# EAGLE design vemag_CPU_v2_2 (EAGLE 9.6.2)

## Sheet 1 of 3: Microcontroller
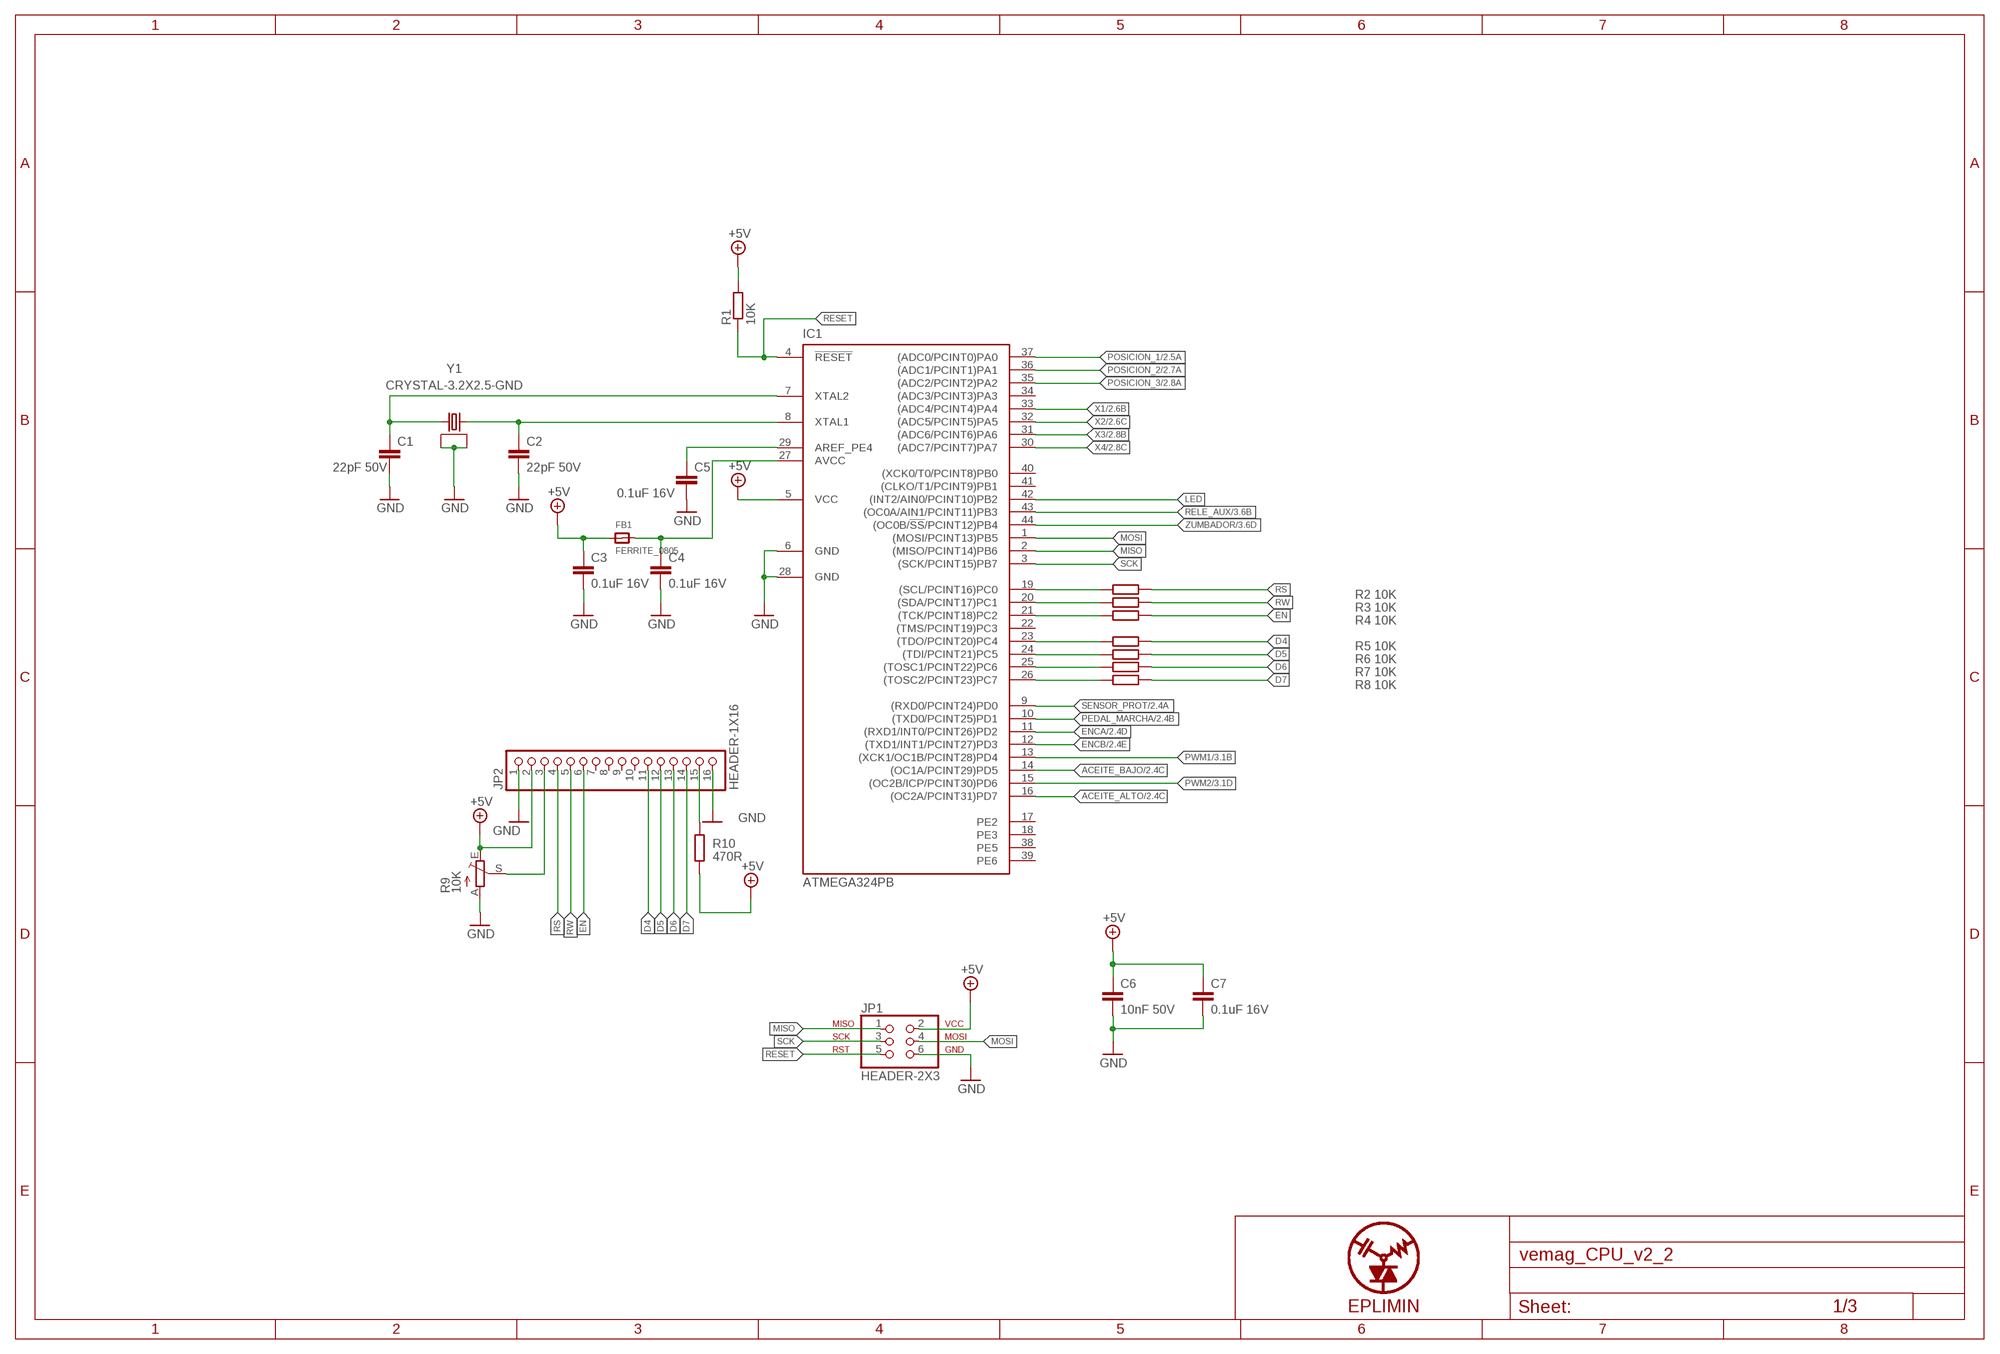
[diagram p0: schematic, sheet 1]

### Parts
C1  22pF 50V  C-EUC0603  [C0603]
C2  22pF 50V  C-EUC0603  [C0603]
C3  0.1uF 16V  C-EUC0603  [C0603]
C4  0.1uF 16V  C-EUC0603  [C0603]
C5  0.1uF 16V  C-EUC0603  [C0603]
C6  10nF 50V  C-EUC0603  [C0603]
C7  0.1uF 16V  C-EUC0603  [C0603]
FB1  FERRITE_0805  [_0805]
IC1  ATMEGA324PB  [TQFP44]
JP1  HEADER-2X3  ISP_AVR_6P  [ISP_AVR_6P]
JP2  HEADER-1X16  PINHD-1X16  [1X16]
R1  10K  R-EU_R0805  [R0805]
R2  10K  R-EU_R0805  [R0805]
R3  10K  R-EU_R0805  [R0805]
R4  10K  R-EU_R0805  [R0805]
R5  10K  R-EU_R0805  [R0805]
R6  10K  R-EU_R0805  [R0805]
R7  10K  R-EU_R0805  [R0805]
R8  10K  R-EU_R0805  [R0805]
R9  10K  TRIM_EU-CA6V  [CA6V]
R10  470R  R-EU_R0805  [R0805]
Y1  CRYSTAL-3.2X2.5-GND  [CRYSTAL-SMD-3.2X2.5MM]

### Nets
+5V: C3.1 C6.1 C7.1 FB1.1 IC1.5(VCC) JP1.2 JP2.2 R1.2 R9.E R10.1 ; also sheet 2
ACEITE_ALTO: IC1.16((OC2A/PCINT31)PD7) ; also sheet 2
ACEITE_BAJO: IC1.14((OC1A/PCINT29)PD5) ; also sheet 2
D4: JP2.11 R5.1
D5: JP2.12 R6.1
D6: JP2.13 R7.1
D7: JP2.14 R8.1
EN: JP2.6 R4.1
ENCA: IC1.11((RXD1/INT0/PCINT26)PD2) ; also sheet 2
ENCB: IC1.12((TXD1/INT1/PCINT27)PD3) ; also sheet 2
GND: C1.2 C2.2 C3.2 C4.2 C5.2 C6.2 C7.2 IC1.6(GND) IC1.28(GND) JP1.6 JP2.1 JP2.16 R9.A Y1.2(GND) Y1.4(GND) ; also sheet 2,3
LED: IC1.42((INT2/AIN0/PCINT10)PB2)
MISO: IC1.2((MISO/PCINT14)PB6) JP1.1
MOSI: IC1.1((MOSI/PCINT13)PB5) JP1.4
N$1: C1.1 IC1.7(XTAL2) Y1.1
N$2: C2.1 IC1.8(XTAL1) Y1.3
N$3: C5.1 IC1.29(AREF_PE4)
N$4: JP2.3 R9.S
N$5: C4.1 FB1.2 IC1.27(AVCC)
N$6: IC1.26((TOSC2/PCINT23)PC7) R8.2
N$7: IC1.25((TOSC1/PCINT22)PC6) R7.2
N$8: IC1.24((TDI/PCINT21)PC5) R6.2
N$9: IC1.23((TDO/PCINT20)PC4) R5.2
N$11: IC1.21((TCK/PCINT18)PC2) R4.2
N$12: IC1.20((SDA/PCINT17)PC1) R3.2
N$13: IC1.19((SCL/PCINT16)PC0) R2.2
N$14: JP2.15 R10.2
PEDAL_MARCHA: IC1.10((TXD0/PCINT25)PD1) ; also sheet 2
POSICION_1: IC1.37((ADC0/PCINT0)PA0) ; also sheet 2
POSICION_2: IC1.36((ADC1/PCINT1)PA1) ; also sheet 2
POSICION_3: IC1.35((ADC2/PCINT2)PA2) ; also sheet 2
PWM1: IC1.13((XCK1/OC1B/PCINT28)PD4) ; also sheet 3
PWM2: IC1.15((OC2B/ICP/PCINT30)PD6) ; also sheet 3
RELE_AUX: IC1.43((OC0A/AIN1/PCINT11)PB3) ; also sheet 3
RESET: IC1.4(!RESET) JP1.5 R1.1
RS: JP2.4 R2.1
RW: JP2.5 R3.1
SCK: IC1.3((SCK/PCINT15)PB7) JP1.3
SENSOR_PROT: IC1.9((RXD0/PCINT24)PD0) ; also sheet 2
X1: IC1.33((ADC4/PCINT4)PA4) ; also sheet 2
X2: IC1.32((ADC5/PCINT5)PA5) ; also sheet 2
X3: IC1.31((ADC6/PCINT6)PA6) ; also sheet 2
X4: IC1.30((ADC7/PCINT7)PA7) ; also sheet 2
ZUMBADOR: IC1.44((OC0B/!SS!/PCINT12)PB4) ; also sheet 3
Unconnected: IC1.22((TMS/PCINT19)PC3) IC1.34((ADC3/PCINT3)PA3) IC1.40((XCK0/T0/PCINT8)PB0) IC1.41((CLKO/T1/PCINT9)PB1) JP2.7 JP2.8 JP2.9 JP2.10

## Sheet 2 of 3: Inputs / Power Supply
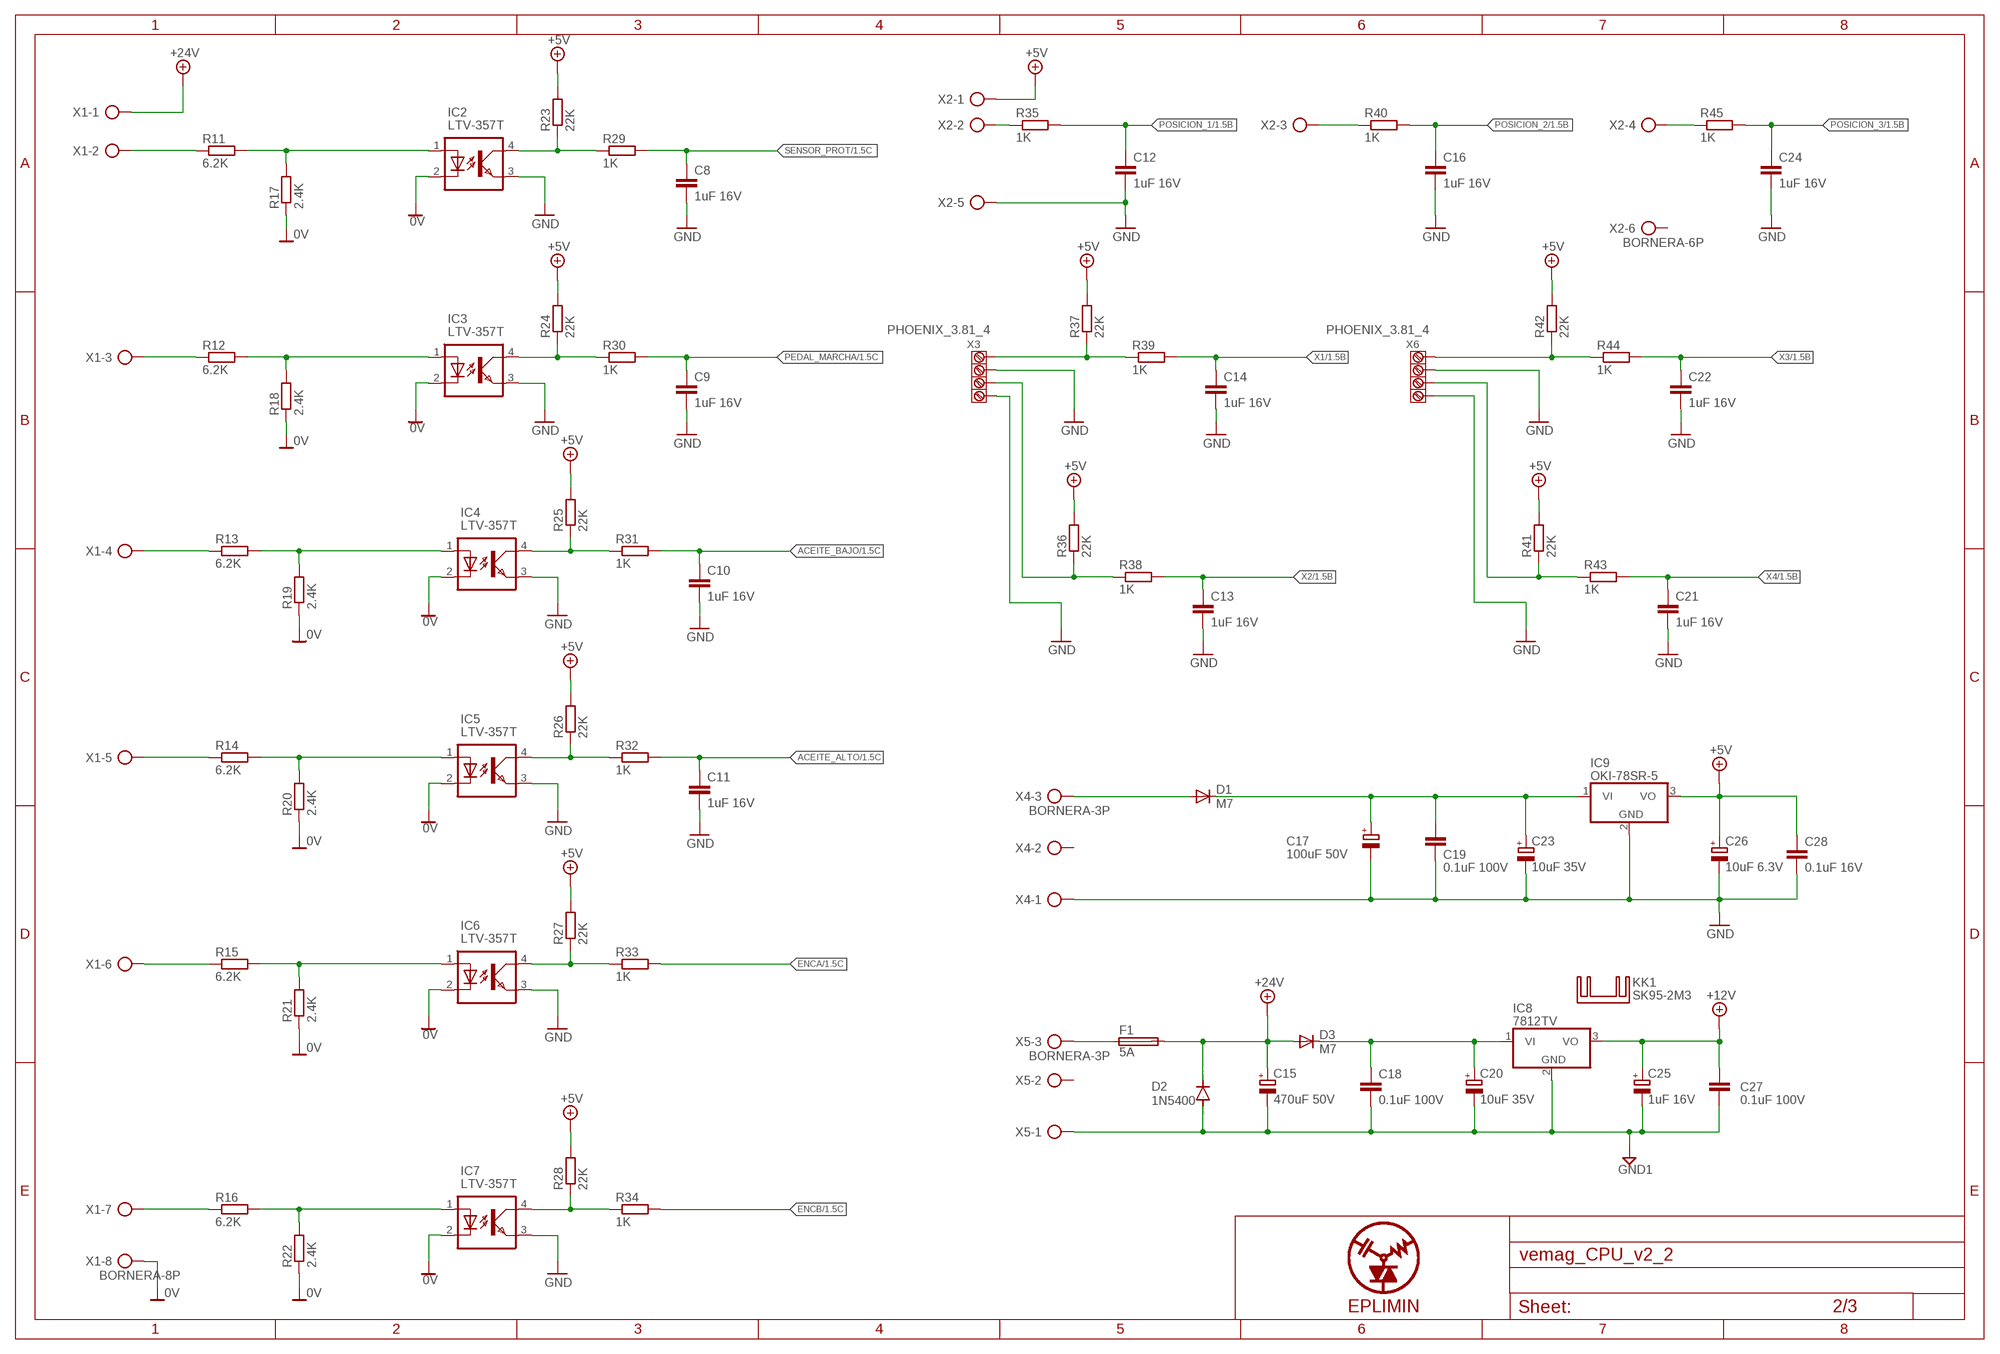
[diagram p1: schematic, sheet 2]

### Parts
C8  1uF 16V  C-EUC0805  [C0805]
C9  1uF 16V  C-EUC0805  [C0805]
C10  1uF 16V  C-EUC0805  [C0805]
C11  1uF 16V  C-EUC0805  [C0805]
C12  1uF 16V  C-EUC0805  [C0805]
C13  1uF 16V  C-EUC0805  [C0805]
C14  1uF 16V  C-EUC0805  [C0805]
C15  470uF 50V  CPOL-EUE10-20  [EB20D]
C16  1uF 16V  C-EUC0805  [C0805]
C17  100uF 50V  CPOL-EUE5-10.5  [E5-10,5]
C18  0.1uF 100V  C-EU050-035X075  [C050-035X075]
C19  0.1uF 100V  C-EU050-035X075  [C050-035X075]
C20  10uF 35V  CPOL-EUSMCD  [SMC_D]
C21  1uF 16V  C-EUC0805  [C0805]
C22  1uF 16V  C-EUC0805  [C0805]
C23  10uF 35V  CPOL-EUSMCD  [SMC_D]
C24  1uF 16V  C-EUC0805  [C0805]
C25  1uF 16V  CPOL-EUSMCC  [SMC_C]
C26  10uF 6.3V  CPOL-EUSMCC  [SMC_C]
C27  0.1uF 100V  C-EU050-035X075  [C050-035X075]
C28  0.1uF 16V  C-EUC0603  [C0603]
D1  M7  [DIODE_DO-214AC]
D2  1N5400  [DO201-15]
D3  M7  [DIODE_DO-214AC]
F1  5A  TR5  [TR5]
IC2  LTV-357T  [LTV-357T]
IC3  LTV-357T  [LTV-357T]
IC4  LTV-357T  [LTV-357T]
IC5  LTV-357T  [LTV-357T]
IC6  LTV-357T  [LTV-357T]
IC7  LTV-357T  [LTV-357T]
IC8  7812TV  [TO220V]
IC9  OKI-78SR-5  OKI-78SR_V  [TO220V-OKI-ISO]
KK1  SK95-2M3  [SK95-2M3]
R11  6.2K  R-EU_R1206  [R1206]
R12  6.2K  R-EU_R1206  [R1206]
R13  6.2K  R-EU_R1206  [R1206]
R14  6.2K  R-EU_R1206  [R1206]
R15  6.2K  R-EU_R1206  [R1206]
R16  6.2K  R-EU_R1206  [R1206]
R17  2.4K  R-EU_R1206  [R1206]
R18  2.4K  R-EU_R1206  [R1206]
R19  2.4K  R-EU_R1206  [R1206]
R20  2.4K  R-EU_R1206  [R1206]
R21  2.4K  R-EU_R1206  [R1206]
R22  2.4K  R-EU_R1206  [R1206]
R23  22K  R-EU_R0805  [R0805]
R24  22K  R-EU_R0805  [R0805]
R25  22K  R-EU_R0805  [R0805]
R26  22K  R-EU_R0805  [R0805]
R27  22K  R-EU_R0805  [R0805]
R28  22K  R-EU_R0805  [R0805]
R29  1K  R-EU_R0805  [R0805]
R30  1K  R-EU_R0805  [R0805]
R31  1K  R-EU_R0805  [R0805]
R32  1K  R-EU_R0805  [R0805]
R33  1K  R-EU_R0805  [R0805]
R34  1K  R-EU_R0805  [R0805]
R35  1K  R-EU_R0805  [R0805]
R36  22K  R-EU_R0805  [R0805]
R37  22K  R-EU_R0805  [R0805]
R38  1K  R-EU_R0805  [R0805]
R39  1K  R-EU_R0805  [R0805]
R40  1K  R-EU_R0805  [R0805]
R41  22K  R-EU_R0805  [R0805]
R42  22K  R-EU_R0805  [R0805]
R43  1K  R-EU_R0805  [R0805]
R44  1K  R-EU_R0805  [R0805]
R45  1K  R-EU_R0805  [R0805]
X1  BORNERA-8P  AK500/8  [AK500/8]
X2  BORNERA-6P  AK500/6  [AK500/6]
X3  PHOENIX_3.81_4  [3.81-4]
X4  BORNERA-3P  AK500/3  [AK500/3]
X5  BORNERA-3P  AK500/3  [AK500/3]
X6  PHOENIX_3.81_4  [3.81-4]

### Nets
0V: IC2.2(CATHODE) IC3.2(CATHODE) IC4.2(CATHODE) IC5.2(CATHODE) IC6.2(CATHODE) IC7.2(CATHODE) R17.1 R18.1 R19.1 R20.1 R21.1 R22.1 X1.8
+5V: C26.+ C28.1 IC9.3(VO) R23.2 R24.2 R25.2 R26.2 R27.2 R28.2 R36.2 R37.2 R41.2 R42.2 X2.1 ; also sheet 1
+12V: C25.+ C27.1 IC8.3(VO) ; also sheet 3
+24V: C15.+ D2.C D3.A F1.2 X1.1 ; also sheet 3
ACEITE_ALTO: C11.1 R32.2 ; also sheet 1
ACEITE_BAJO: C10.1 R31.2 ; also sheet 1
ENCA: R33.2 ; also sheet 1
ENCB: R34.2 ; also sheet 1
GND: C8.2 C9.2 C10.2 C11.2 C12.2 C13.2 C14.2 C16.2 C17.- C19.2 C21.2 C22.2 C23.- C24.2 C26.- C28.2 IC2.3(EM) IC3.3(EM) IC4.3(EM) IC5.3(EM) IC6.3(EM) IC7.3(EM) IC9.2(GND) X2.5 X3.2 X3.4 X4.1 X6.2 X6.4 ; also sheet 1,3
GND1: C15.- C18.2 C20.- C25.- C27.2 D2.A IC8.2(GND) X5.1 ; also sheet 3
N$10: D1.A X4.3
N$17: IC2.1(ANODE) R11.2 R17.2
N$18: IC2.4(COL) R23.1 R29.1
N$19: R35.1 X2.2
N$21: IC3.1(ANODE) R12.2 R18.2
N$22: C18.1 C20.+ D3.C IC8.1(VI)
N$26: IC3.4(COL) R24.1 R30.1
N$29: IC4.1(ANODE) R13.2 R19.2
N$30: IC4.4(COL) R25.1 R31.1
N$33: IC5.1(ANODE) R14.2 R20.2
N$34: IC5.4(COL) R26.1 R32.1
N$37: IC6.1(ANODE) R15.2 R21.2
N$38: IC6.4(COL) R27.1 R33.1
N$41: IC7.1(ANODE) R16.2 R22.2
N$42: IC7.4(COL) R28.1 R34.1
N$44: R16.1 X1.7
N$45: R15.1 X1.6
N$46: R14.1 X1.5
N$47: R13.1 X1.4
N$48: R12.1 X1.3
N$49: R11.1 X1.2
N$53: F1.1 X5.3
N$60: C17.+ C19.1 C23.+ D1.C IC9.1(VI)
N$68: R40.1 X2.3
N$69: R45.1 X2.4
N$70: R37.1 R39.1 X3.1
N$71: R36.1 R38.1 X3.3
N$72: R42.1 R44.1 X6.1
N$74: R41.1 R43.1 X6.3
PEDAL_MARCHA: C9.1 R30.2 ; also sheet 1
POSICION_1: C12.1 R35.2 ; also sheet 1
POSICION_2: C16.1 R40.2 ; also sheet 1
POSICION_3: C24.1 R45.2 ; also sheet 1
SENSOR_PROT: C8.1 R29.2 ; also sheet 1
X1: C14.1 R39.2 ; also sheet 1
X2: C13.1 R38.2 ; also sheet 1
X3: C22.1 R44.2 ; also sheet 1
X4: C21.1 R43.2 ; also sheet 1
Unconnected: X2.6 X4.2 X5.2

## Sheet 3 of 3: Outputs
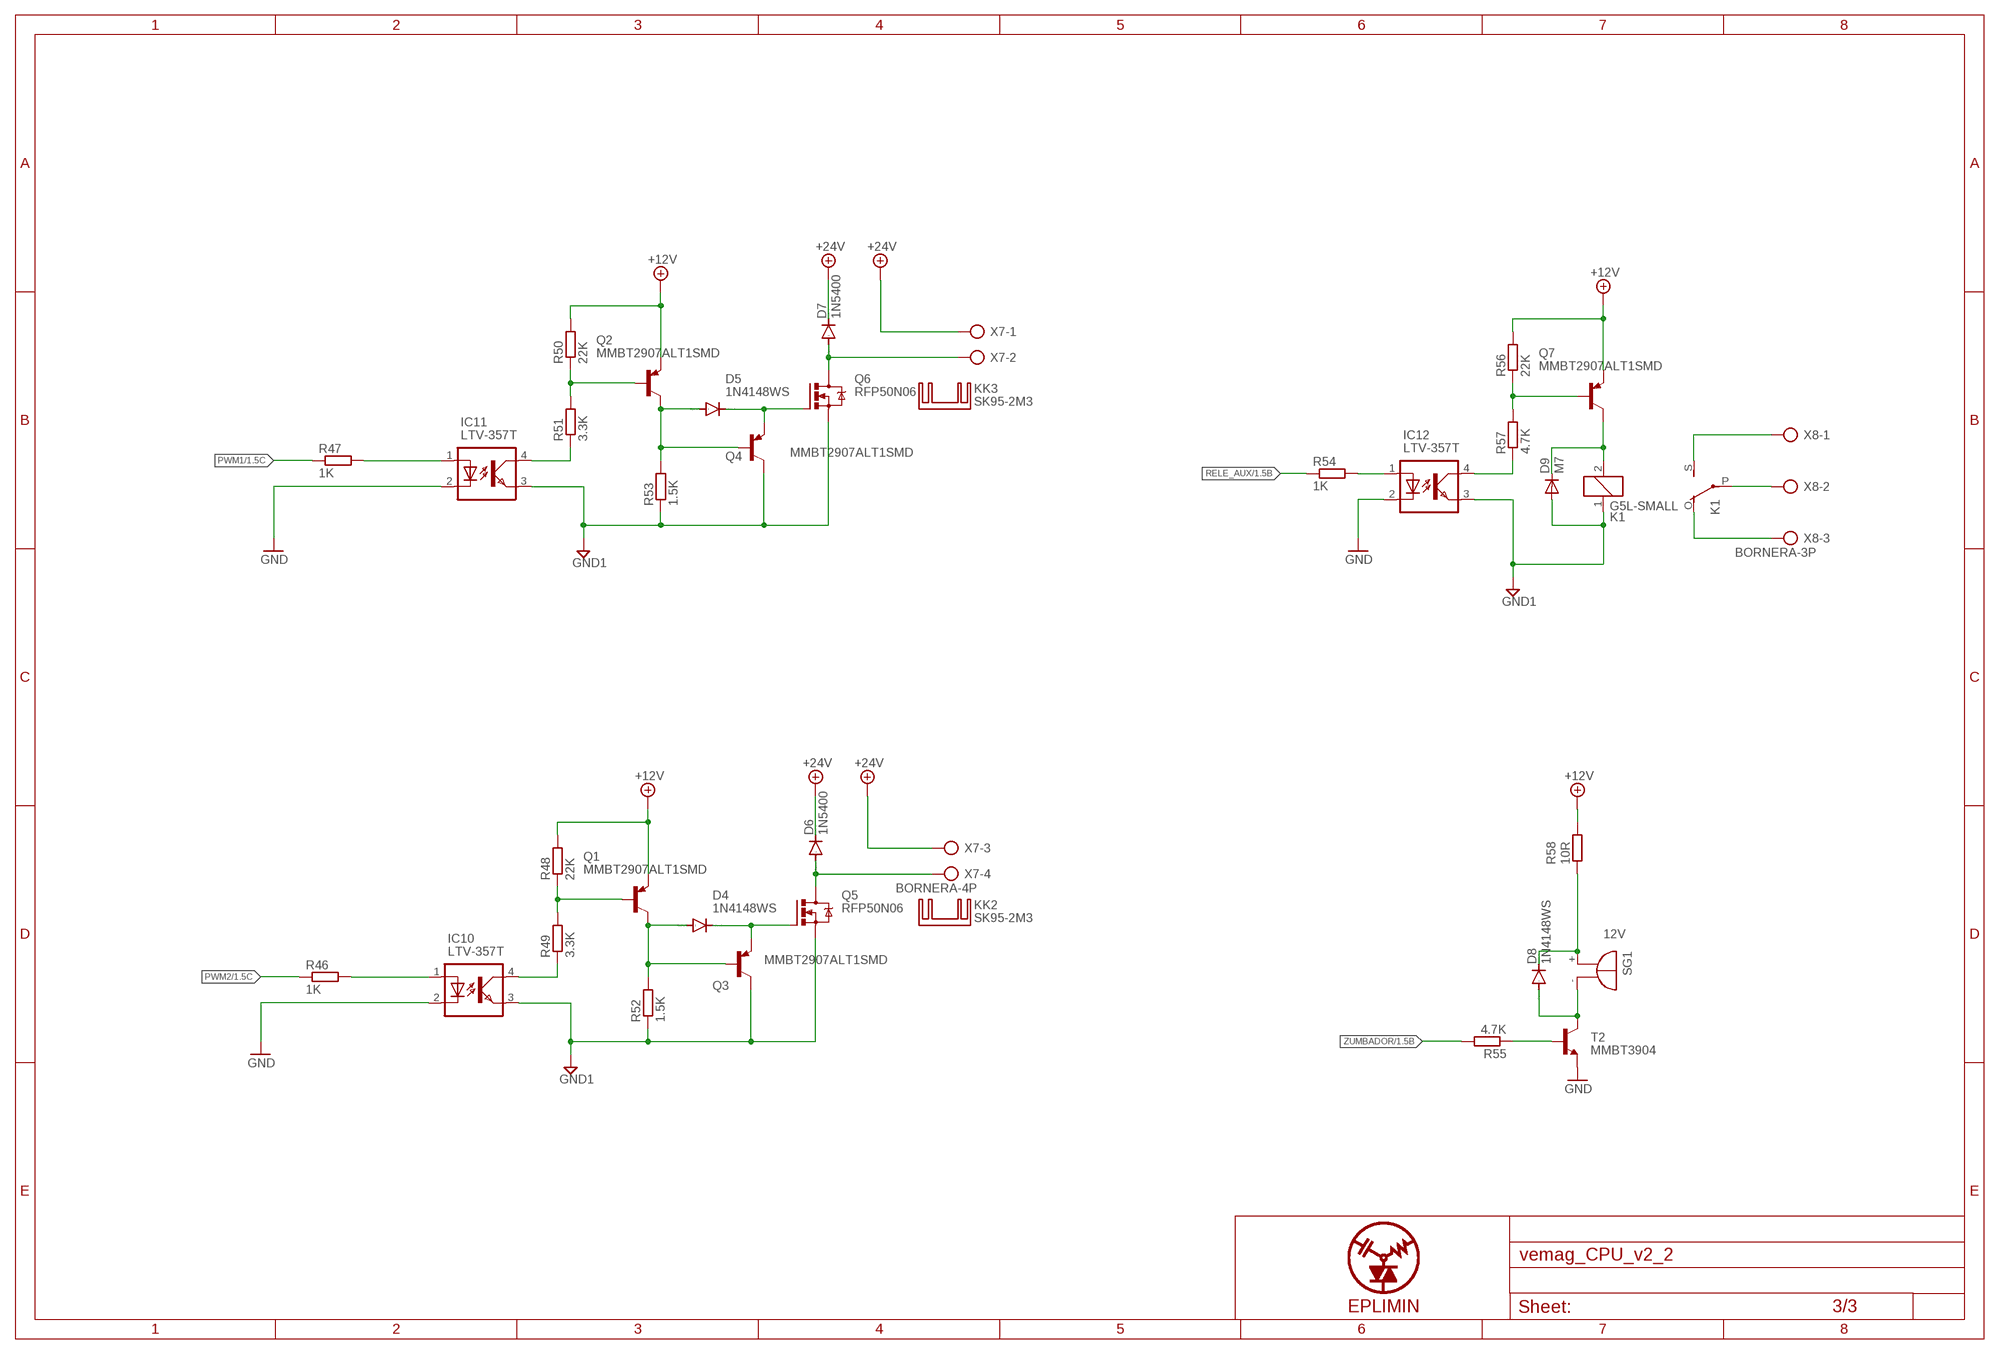
[diagram p2: schematic, sheet 3]

### Parts
D4  1N4148WS  [DIODE_SOD323-W]
D5  1N4148WS  [DIODE_SOD323-W]
D6  1N5400  [DO201-15]
D7  1N5400  [DO201-15]
D8  1N4148WS  [DIODE_SOD323-W]
D9  M7  [DIODE_DO-214AC]
IC10  LTV-357T  [LTV-357T]
IC11  LTV-357T  [LTV-357T]
IC12  LTV-357T  [LTV-357T]
K1  G5L-SMALL  [G5LE-SMALL]
KK2  SK95-2M3  [SK95-2M3]
KK3  SK95-2M3  [SK95-2M3]
Q1  MMBT2907ALT1SMD  [SOT23-BEC]
Q2  MMBT2907ALT1SMD  [SOT23-BEC]
Q3  MMBT2907ALT1SMD  [SOT23-BEC]
Q4  MMBT2907ALT1SMD  [SOT23-BEC]
Q5  RFP50N06  IRF740  [TO220BV]
Q6  RFP50N06  IRF740  [TO220BV]
Q7  MMBT2907ALT1SMD  [SOT23-BEC]
R46  1K  R-EU_R0805  [R0805]
R47  1K  R-EU_R0805  [R0805]
R48  22K  R-EU_R0805  [R0805]
R49  3.3K  R-EU_R0805  [R0805]
R50  22K  R-EU_R0805  [R0805]
R51  3.3K  R-EU_R0805  [R0805]
R52  1.5K  R-EU_R1206  [R1206]
R53  1.5K  R-EU_R1206  [R1206]
R54  1K  R-EU_R0805  [R0805]
R55  4.7K  R-EU_R0805  [R0805]
R56  22K  R-EU_R0805  [R0805]
R57  4.7K  R-EU_R0805  [R0805]
R58  10R  R-EU_R0805  [R0805]
SG1  12V  F/TMB  [F/TMB]
T2  MMBT3904  MMBT3904LT1-NPN-SOT23-BEC  [SOT23-BEC]
X7  BORNERA-4P  AK500/4  [AK500/4]
X8  BORNERA-3P  AK500/3  [AK500/3]

### Nets
+12V: Q1.E Q2.E Q7.E R48.2 R50.2 R56.2 R58.1 ; also sheet 2
+24V: D6.C D7.C X7.1 X7.3 ; also sheet 2
GND: IC10.2(CATHODE) IC11.2(CATHODE) IC12.2(CATHODE) T2.E ; also sheet 1,2
GND1: D9.A IC10.3(EM) IC11.3(EM) IC12.3(EM) K1.1 Q3.C Q4.C Q5.S Q6.S R52.1 R53.1 ; also sheet 2
N$27: IC11.1(ANODE) R47.2
N$35: D8.C R58.2 SG1.+
N$39: D5.A Q2.C Q4.B R53.2
N$43: IC11.4(COL) R51.1
N$50: Q2.B R50.1 R51.2
N$51: IC10.1(ANODE) R46.2
N$52: D5.C Q4.E Q6.G
N$54: D7.A Q6.D X7.2
N$55: K1.S(2:S) X8.1
N$56: K1.P(2:P) X8.2
N$57: IC10.4(COL) R49.1
N$58: Q1.B R48.1 R49.2
N$59: D4.A Q1.C Q3.B R52.2
N$61: D4.C Q3.E Q5.G
N$62: D6.A Q5.D X7.4
N$63: IC12.1(ANODE) R54.2
N$64: IC12.4(COL) R57.1
N$65: Q7.B R56.1 R57.2
N$66: D9.C K1.2 Q7.C
N$67: K1.O(2:O) X8.3
N$73: R55.1 T2.B
N$119: D8.A SG1.- T2.C
PWM1: R47.1 ; also sheet 1
PWM2: R46.1 ; also sheet 1
RELE_AUX: R54.1 ; also sheet 1
ZUMBADOR: R55.2 ; also sheet 1

## Power pins joined to a net without a drawn wire
PE2: IC1.17(PE2)
PE3: IC1.18(PE3)
PE5: IC1.38(PE5)
PE6: IC1.39(PE6)

## Library data of the parts
C1-C14 C16 C18 C19 C21 C22 C24 C27 C28 = 1-RCL:C-EU: CAPACITOR, European symbol; SPICEPREFIX: C
C15 C17 C20 C23 C25 C26 = 1-RCL:CPOL-EU: POLARIZED CAPACITOR, European symbol
D1 D3 D9 = 1-Diode:M7
D2 D6 D7 = diode:1N5400: DIODE standard rectifier, 3 A, 50 V (Motorola)
D4 D5 D8 = 1-Diode:1N4148WS
F1 = fuse:TR5: FUSE Wickmann; OC_FARNELL: unknown; OC_NEWARK: unknown
FB1 = 1-RCL:FERRITE
IC1 = 1-IC-Microcontroller-and-FPGA:ATMEGA324PB
IC2-IC7 IC10-IC12 = 1-Optoisolator:LTV-357T: Optocoupler Transistor Output, 35V, SOP4 Lite-On LTV-357T DC Input Transistor Output Optocoupler, Surface Mount, 4-Pin Mini-Flat Source: Datasheet <http://uk.rs-online.com/web/p/products/6912088>; ALLIED_NUMBER: R1038082; ALLIED_PRICE/STOCK: http://www.alliedelec.com/lite-on-ltv-357t/R1038082/; ARROW_PART_NUMBER: LTV-357T; ARROW_PRICE/STOCK: https://www.arrow.com/en/products/ltv-357t/lite-on-technology; DESCRIPTION: Optocoupler Transistor Output, 35V, SOP4 Lite-On LTV-357T DC Input Transistor Output Optocoupler, Surface Mount, 4-Pin Mini-Flat; HEIGHT: mm; MANUFACTURER_NAME: Lite-On; MANUFACTURER_PART_NUMBER: LTV-357T; RS_PART_NUMBER: 1732645; RS_PRICE/STOCK: http://uk.rs-online.com/web/p/products/1732645
IC8 = 1-IC-Regulators:78*: Positive VOLTAGE REGULATOR Source: http://cache.national.com/ds/LM/LM78L05.pdf http://www.fairchildsemi.com/ds/LM/LM7805.pdf
IC9 = 1-IC-Regulators:OKI-78SR_V: OKI-78SR
JP1 = 1-Connectors:ISP_AVR_6P: PIN HEADER
JP2 = 1-Pinhead:PINHD-1X16: PIN HEADER
K1 = 1-Relay:G5L-SMALL: RELAY 1 x switch, 10 A/120 V AC, 8 A/30 V ADC, Omron; OC_FARNELL: unknown; OC_NEWARK: unknown
KK1-KK3 = 1-Heatsink:SK95-2M3: HEATSINK manufacturer Fischer/distributor Buerklin
Q1-Q4 Q7 = transistor-pnp:MMBT2907*: PNP Transistror
Q5 Q6 = transistor-power:IRF740: N-CHANNEL MOS FET
R1-R8 R10-R58 = 1-RCL:R-EU_: RESISTOR, European symbol
R9 = 1-RCL:TRIM_EU-: POTENTIOMETER GF063P1, CT-6-EP, CT6EP
SG1 = buzzer:F/TMB: BUZZER Source: Buerklin; OC_FARNELL: unknown; OC_NEWARK: unknown
T2 = 1-Transistor:*-NPN-: NPN Transistror BF959 corrected 2008.03.06
X1 = 1-Terminal-Blocks:AK500/8: CONNECTOR; OC_FARNELL: unknown; OC_NEWARK: unknown
X2 = 1-Terminal-Blocks:AK500/6: CONNECTOR; OC_FARNELL: unknown; OC_NEWARK: unknown
X3 X6 = 1-Terminal-Blocks:PHOENIX_3.81_4
X4 X5 X8 = 1-Terminal-Blocks:AK500/3: CONNECTOR; OC_FARNELL: unknown; OC_NEWARK: unknown
X7 = 1-Terminal-Blocks:AK500/4: CONNECTOR; OC_FARNELL: unknown; OC_NEWARK: unknown
Y1 = 1-Crystal-and-Oscillators:CRYSTAL-3.2X2.5-GND

## Board
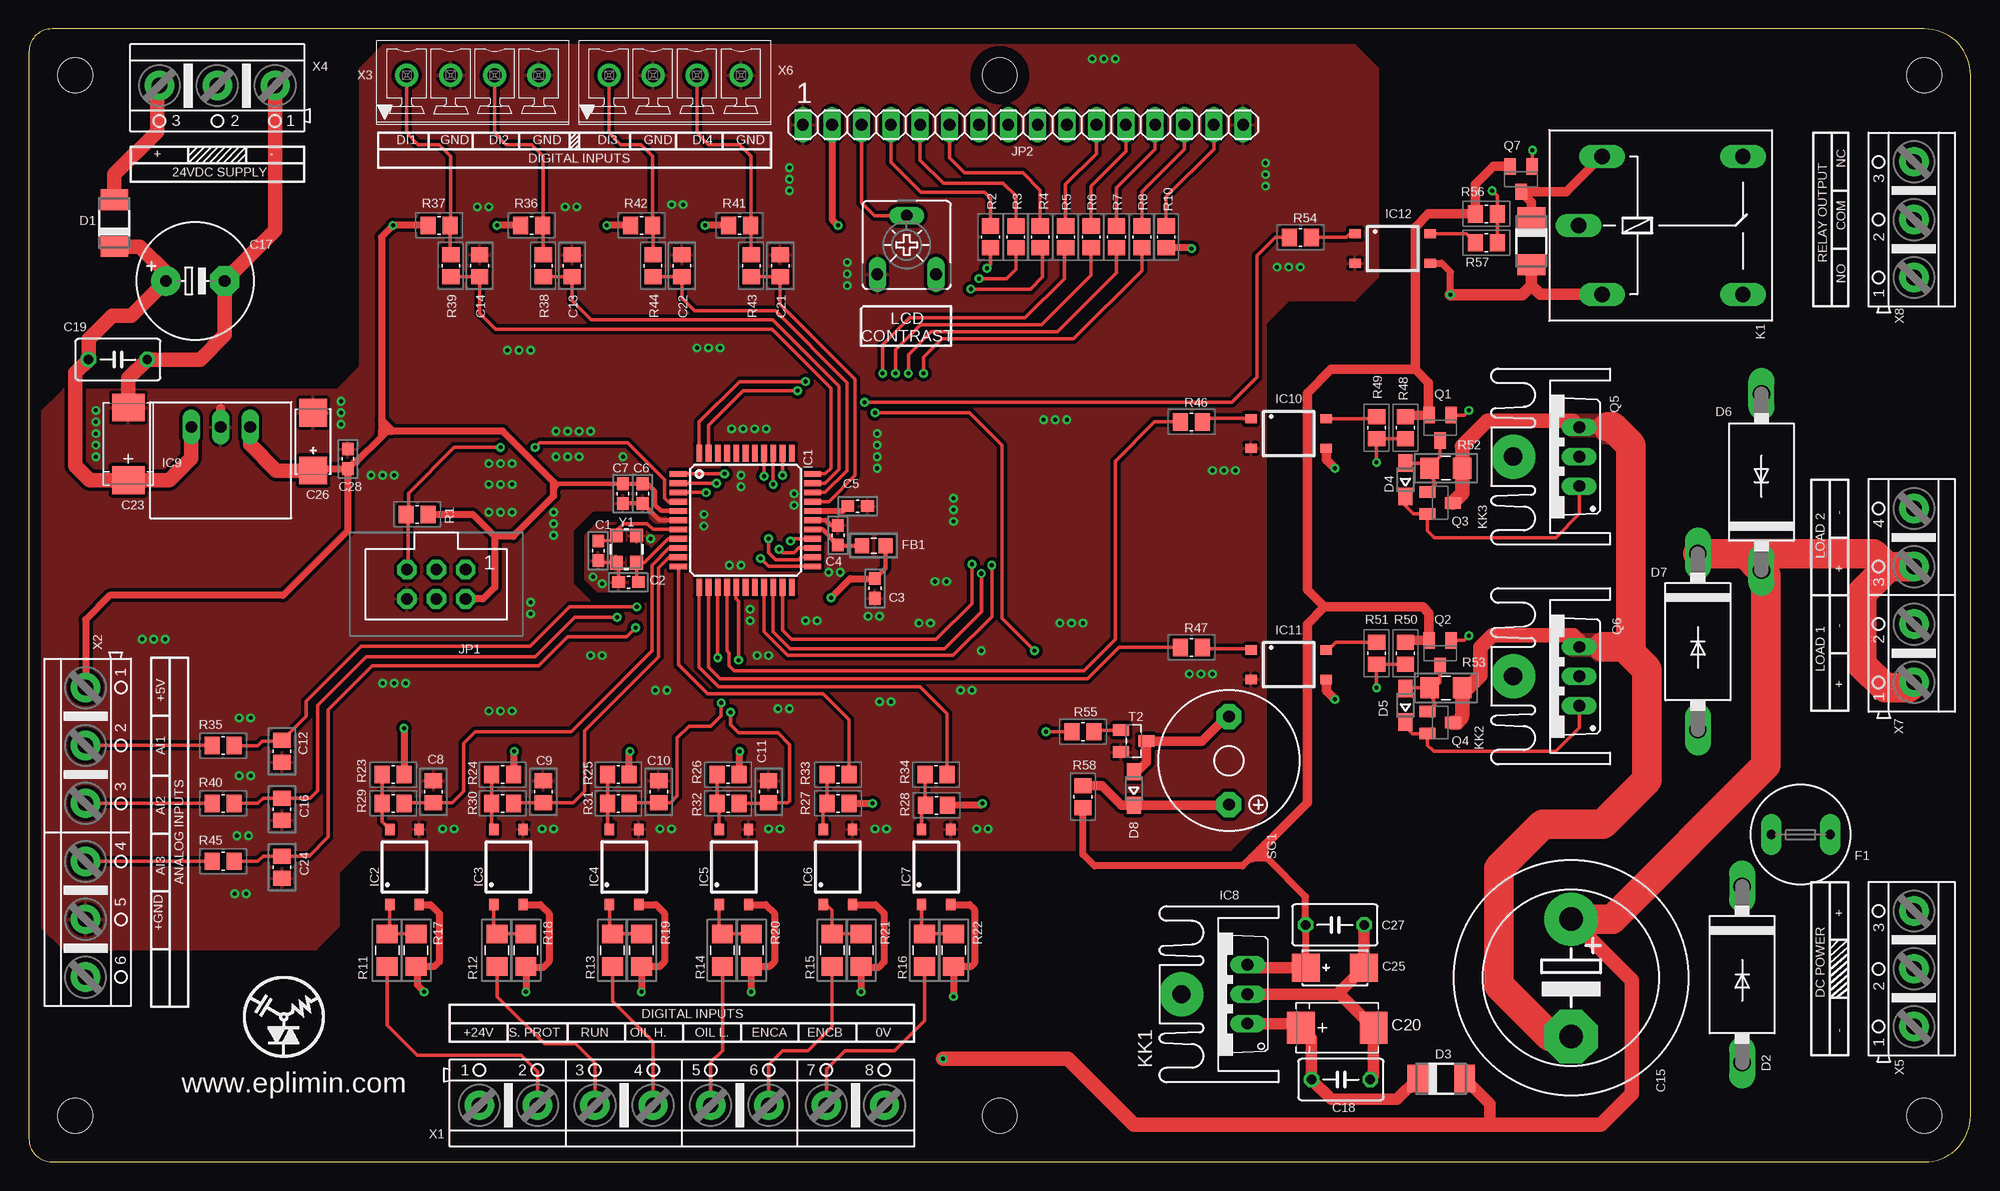
[diagram p3: board, top side]
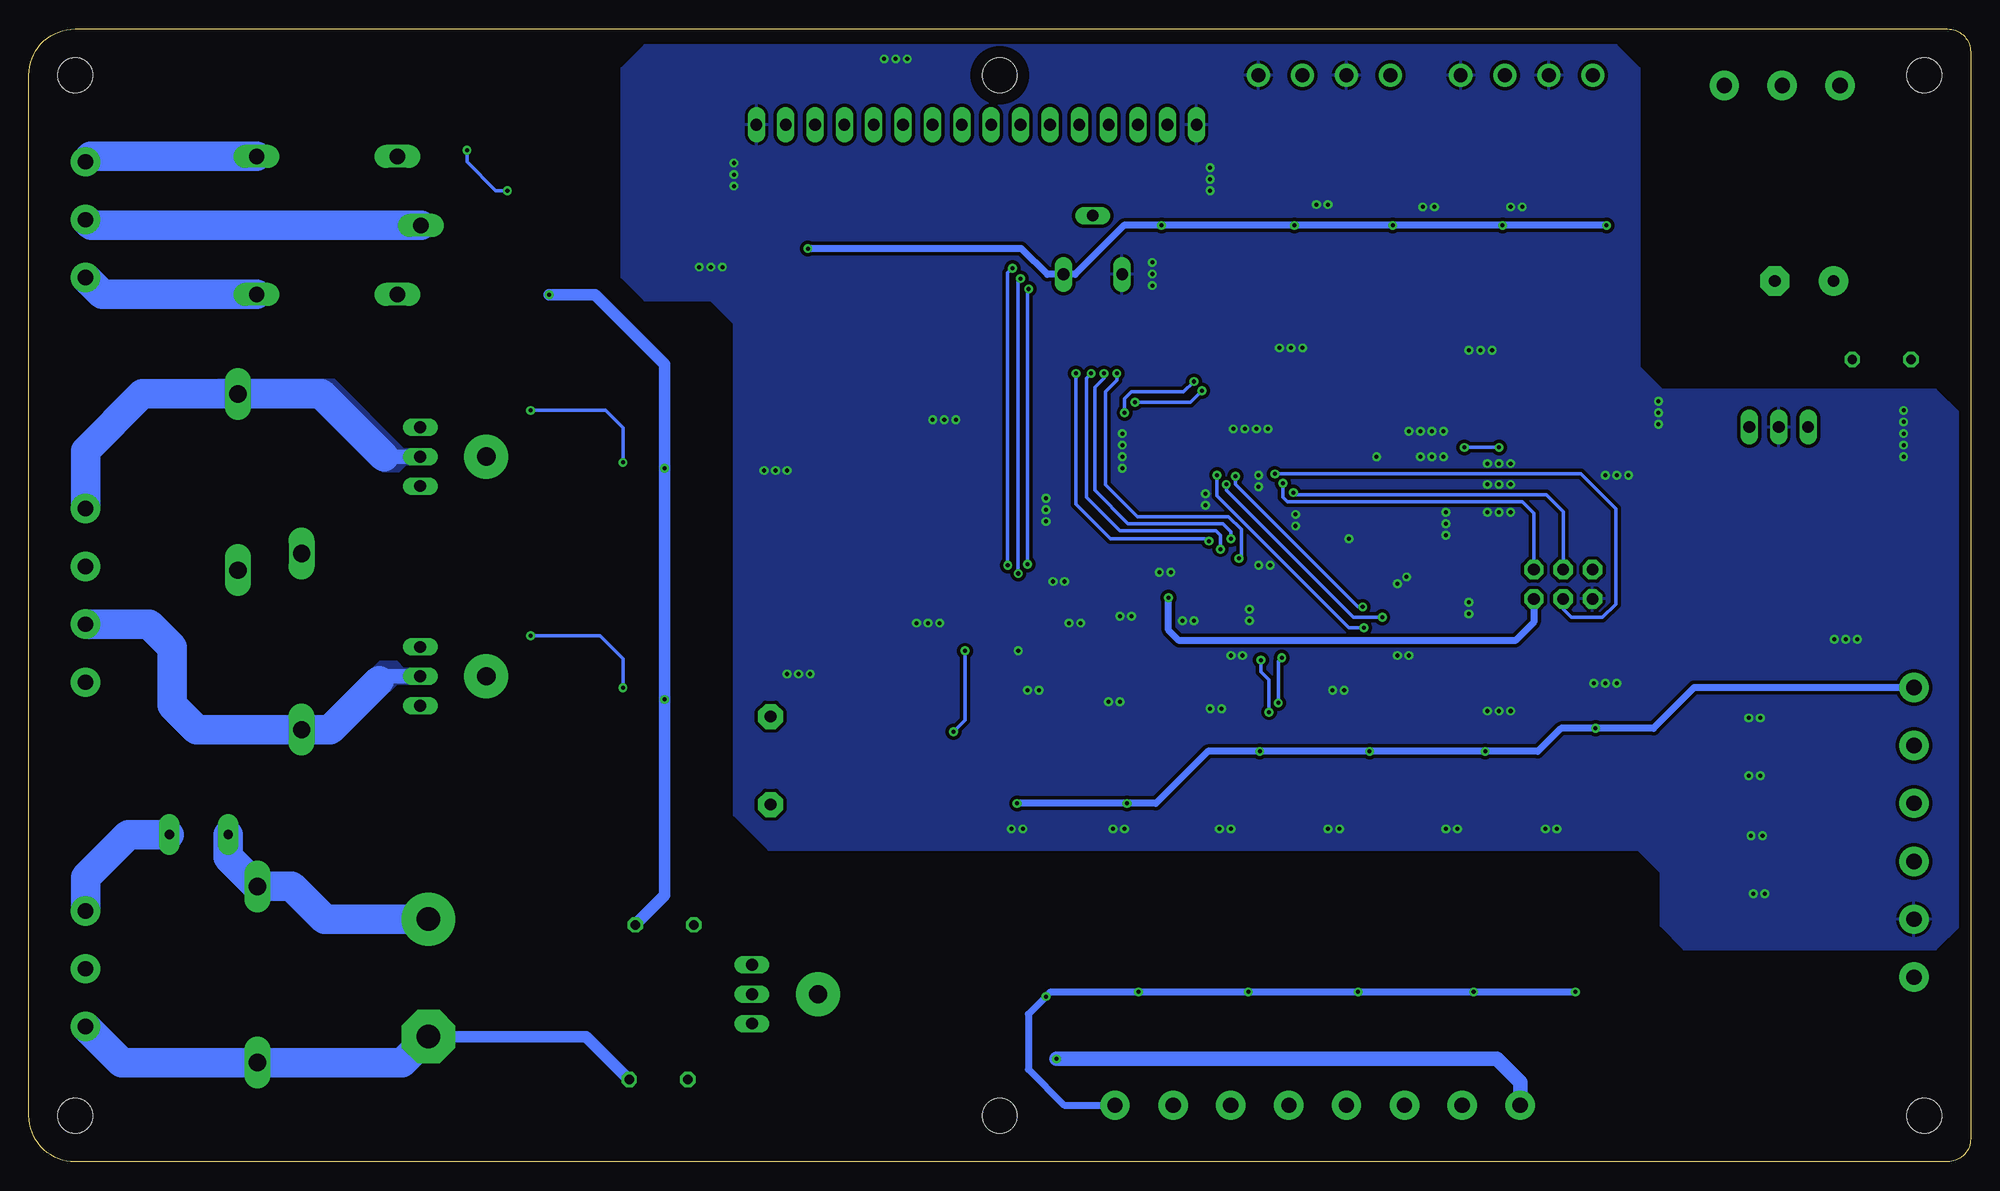
[diagram p4: board, bottom side, seen from below]

Size 168 x 98 mm. Coordinates in mm from the lower left corner, seen from the top.
Outline: 2,0 164,0 arc90 168,4 168,94 arc90 164,98 2,98 arc90 0,96 0,2 arc90 2,0
Copper layers (1*16): Top 0.035mm / dielectric 1.5mm / Bottom 0.035mm
Design rules "default *": minimum track width 6mil, minimum drill 0.35mm, track to track 10mil, track to pad 10mil, pad to pad 10mil, via to via 10mil, smd to smd 10mil, copper to edge 40mil, drill to drill 6mil, minimum pad ring 10mil, minimum via ring 8mil, stop-mask expansion 4mil, vias tented up to drill 0mil, thermal gap 10mil
Holes 3 mm at 4,94 84,94 84,4 4,4 164,94 164,4
tRestrict: 8 lines

### Footprints (pad centres in the part's own frame; a part is rotated, then mirrored left to right if it is on the bottom)
C0603 = smd 1.1 x 1: 1 -0.85,0; 2 0.85,0
C0805 = smd 1.3 x 1.5: 1 -0.95,0; 2 0.95,0
EB20D = drill 2.007 pad 4.597: + -5.08,0 | drill 2.007 pad 4.597 octagon: - 5.08,0
E5-10,5 = drill 1.016 pad 2.54: + -2.54,0 | drill 1.016 pad 2.54 octagon: - 2.54,0
C050-035X075 = drill 0.813 octagon: 1 -2.54,0; 2 2.54,0
SMC_D = smd 2.4 x 2.8: + -3.15,0; - 3.15,0
SMC_C = smd 2.4 x 2.4: + 2.5,0; - -2.5,0
DIODE_DO-214AC = smd 1.8 x 2.4: A -2.025,0; C 2.025,0
DO201-15 = drill 1.499 long: A 7.62,0; C -7.62,0
DIODE_SOD323-W = smd 1.5 x 1.2: A 1.45,0; C -1.45,0
TR5 = drill 0.813 pad 1.778 long: 1 -2.54,0; 2 2.54,0
_0805 = smd 1.2 x 1.3: 1 -1.016,0; 2 1.016,0
TQFP44 = smd 0.5 x 1.5: 1 -4,-5.8; 2 -3.2,-5.8; 3 -2.4,-5.8; 4 -1.6,-5.8; 5 -0.8,-5.8; 6 0,-5.8; 7 0.8,-5.8; 8 1.6,-5.8; 9 2.4,-5.8; 10 3.2,-5.8; 11 4,-5.8; 23 4,5.8; 24 3.2,5.8; 25 2.4,5.8; 26 1.6,5.8; 27 0.8,5.8; 28 0,5.8; 29 -0.8,5.8; 30 -1.6,5.8; 31 -2.4,5.8; 32 -3.2,5.8; 33 -4,5.8 | smd 1.5 x 0.5: 12 5.8,-4; 13 5.8,-3.2; 14 5.8,-2.4; 15 5.8,-1.6; 16 5.8,-0.8; 17 5.8,0; 18 5.8,0.8; 19 5.8,1.6; 20 5.8,2.4; 21 5.8,3.2; 22 5.8,4; 34 -5.8,4; 35 -5.8,3.2; 36 -5.8,2.4; 37 -5.8,1.6; 38 -5.8,0.8; 39 -5.8,0; 40 -5.8,-0.8; 41 -5.8,-1.6; 42 -5.8,-2.4; 43 -5.8,-3.2; 44 -5.8,-4
LTV-357T = smd 1 x 0.8: 1 -3.25,1.27; 2 -3.25,-1.27; 3 3.25,-1.27; 4 3.25,1.27
TO220V = drill 1.016 long: 1 -2.54,-2.54; 2 0,-2.54; 3 2.54,-2.54
TO220V-OKI-ISO = drill 1.016 long: 1 -2.54,-2.54; 2 0,-2.54; 3 2.54,-2.54
ISP_AVR_6P = drill 1.016 pad 1.676 octagon: 1 -2.54,-1.27; 2 -2.54,1.27; 3 0,-1.27; 4 0,1.27; 5 2.54,-1.27; 6 2.54,1.27
1X16 = drill 1.016 long: 1 -19.05,0; 2 -16.51,0; 3 -13.97,0; 4 -11.43,0; 5 -8.89,0; 6 -6.35,0; 7 -3.81,0; 8 -1.27,0; 9 1.27,0; 10 3.81,0; 11 6.35,0; 12 8.89,0; 13 11.43,0; 14 13.97,0; 15 16.51,0; 16 19.05,0
G5LE-SMALL = drill 1.321 long: 1 -7.493,-5.969; 2 -7.493,5.969; O 4.699,5.969; P -9.525,0; S 4.699,-5.969
SK95-2M3 = drill 1.587 pad 3.81: P$1 0,3.175
SOT23-BEC = smd 1 x 1.4: B -0.95,-1.1; C 0,1.1; E 0.95,-1.1
TO220BV = drill 1.016 long: D 0,-2.54; G -2.54,-2.54; S 2.54,-2.54
R0805 = smd 1.3 x 1.5: 1 -0.95,0; 2 0.95,0
CA6V = drill 1.016 long: A -2.54,-2.54; E 2.54,-2.54; S 0,2.54
R1206 = smd 1.6 x 1.803: 1 -1.422,0; 2 1.422,0
F/TMB = drill 1.016 pad 2.159 octagon: + 3.81,0; - -3.81,0
SOT23-BEC' = smd 1.4 x 1: B -1.1,0.95; C 1.1,0; E -1.1,-0.95
AK500/8 = drill 1.321 pad 2.54: 1 -17.526,0; 2 -12.497,0; 3 -7.518,0; 4 -2.489,0; 5 2.489,0; 6 7.518,0; 7 12.497,0; 8 17.526,0
AK500/6 = drill 1.321 pad 2.54: 1 -12.522,0; 2 -7.518,0; 3 -2.515,0; 4 2.515,0; 5 7.518,0; 6 12.522,0
3.81-4 = drill 1.2 pad 2: 1 -3.81,0; 2 0,0; 3 3.81,0; 4 7.62,0
AK500/3 = drill 1.321 pad 2.54: 1 -5.004,0; 2 0,0; 3 5.004,0
AK500/4 = drill 1.321 pad 2.54: 1 -7.518,0; 2 -2.489,0; 3 2.489,0; 4 7.518,0
CRYSTAL-SMD-3.2X2.5MM = smd 1.2 x 1.1: 1 -1.175,-0.875; 2 1.175,-0.875; 3 1.175,0.875; 4 -1.175,0.875

### Placement (x,y rotation side)
C1  49.26,52.86 270 top
C2  51.87,50.14 180 top
C3  73.2,49.6 270 top
C4  70,54.2 90 top
C5  71.71,56.72 0 top
C6  53.1,57.8 270 top
C7  51.4,57.8 270 top
C8  35,32 90 top
C9  44.5,32 90 top
C10  54.5,32 90 top
C11  64,32 90 top
C12  21.9,35.5 270 top
C13  47,77.5 90 top
C14  39,77.5 90 top
C15  133.43,15.92 270 top
C16  21.9,30.5 270 top
C17  14.4,76.2 0 top
C18  113.52,7.12 0 top
C19  7.7,69.4 0 top
C20  113.2,11.6 0 top
C21  65,77.5 90 top
C22  56.5,77.5 90 top
C23  8.6,62.1 90 top
C24  21.9,25.5 270 top
C25  113,16.8 180 top
C26  24.6,62.3 270 top
C27  113,20.5 0 top
C28  27.6,60.8 90 top
D1  7.4,81.2 270 top
D2  148.23,16.2 270 top
D3  122.2,7.2 180 top
D4  119.1,59 90 top
D5  119.1,39.5 90 top
D6  149.9,58.8 90 top
D7  144.4,45 270 top
D8  95.6,32.3 90 top
D9  130,79.63 90 top
F1  153.3,28.3 180 top
FB1  73.1,53.3 180 top
IC1  62,55.5 270 top
IC2  32.5,25.5 90 top
IC3  41.5,25.5 90 top
IC4  51.5,25.5 90 top
IC5  61,25.5 90 top
IC6  70,25.5 90 top
IC7  78.5,25.5 90 top
IC8  102.9,14.5 90 top
IC9  16.6,66.1 0 top
IC10  109,63 0 top
IC11  109,43 0 top
IC12  118,79 0 top
JP1  35.25,49.96 180 top
JP2  86.01,89.71 0 top
K1  143.6,81 0 top
KK1  102.9,14.5 90 top
KK2  131.6,42 90 top
KK3  131.6,61 90 top
Q1  122.1,63.5 180 top
Q2  122.1,44 180 top
Q3  122.1,57 270 top
Q4  122.1,38 270 top
Q5  131.6,61 90 top
Q6  131.6,42 90 top
Q7  129.1,85 180 top
R1  33.6,56 0 top
R2  83.2,80 270 top
R3  85.4,80 270 top
R4  87.5,80 270 top
R5  89.7,80 270 top
R6  91.9,80 270 top
R7  94.1,80 270 top
R8  96.3,80 270 top
R9  75.95,79.31 0 top
R10  98.4,80 90 top
R11  31,18.3 90 top
R12  40.5,18.3 90 top
R13  50.5,18.3 90 top
R14  60,18.3 90 top
R15  69.5,18.3 90 top
R16  77.5,18.3 90 top
R17  33.5,18.3 90 top
R18  43,18.3 90 top
R19  53,18.3 90 top
R20  62.5,18.3 90 top
R21  72,18.3 90 top
R22  80,18.3 90 top
R23  31.5,33.5 0 top
R24  41,33.5 0 top
R25  51,33.5 0 top
R26  60.5,33.5 0 top
R27  70,31 0 top
R28  78.54,30.84 0 top
R29  31.5,31 0 top
R30  41,31 0 top
R31  51,31 0 top
R32  60.5,31 0 top
R33  70,33.5 0 top
R34  78.5,33.5 0 top
R35  16.8,36 0 top
R36  43.5,81 180 top
R37  35.5,81 180 top
R38  44.5,77.5 270 top
R39  36.5,77.5 270 top
R40  16.8,31 0 top
R41  61.5,81 180 top
R42  53,81 180 top
R43  62.5,77.5 270 top
R44  54,77.5 270 top
R45  16.8,26 0 top
R46  100.6,64 0 top
R47  100.6,44.5 0 top
R48  119.1,63.5 90 top
R49  116.6,63.5 270 top
R50  119.1,44 90 top
R51  116.6,44 270 top
R52  122.6,60 180 top
R53  122.6,41 180 top
R54  110.02,79.96 0 top
R55  91.2,37.2 180 top
R56  126.1,82 180 top
R57  126.1,79.5 0 top
R58  91.2,31.6 90 top
SG1  103.83,34.71 270 top
T2  MMBT3904  [SOT23-BEC']  95.6,36.4 0 top
X1  56.5,4.9 0 top
X2  4.9,28.5 270 top
X3  36.5,94 0 top
X4  16.3,93.1 180 top
X5  163.1,16.7 90 top
X6  54,94 0 top
X7  163.1,49 90 top
X8  163.1,81.5 90 top
Y1  51.7,53 270 top

### Tracks (layer width: path | path; a pad name or v marks a point on that pad's centre or on a via)
0V  (via drill 0.35)
  Top 0.61: IC7.2 81.4,22.25 81.8,21.85 81.8,17.18 81.5,16.88 R22.1 v80,14.3 | IC5.2 63.75,22.25 64.5,21.5 64.5,17.3 64.08,16.88 R20.1 v62.5,14.7 | IC4.2 54.25,22.25 55,21.5 55,17.3 54.58,16.88 R19.1 v53,14.7 | IC3.2 44.25,22.25 45,21.5 45,17.3 44.5,16.8 43.08,16.8 R18.1 v43,14.7 | IC2.2 34.75,22.25 35.5,21.5 35.5,17.3 35.08,16.88 R17.1 33.6,16.78 33.6,15.3 v34.2,14.7 | v72,14.7 R21.1 72.08,16.8 73.5,16.8 74,17.3 74,21.5 73.25,22.25 IC6.2
  Bottom 0.61: v34.2,14.7 v43,14.7 v53,14.7 v62.5,14.7 v72,14.7 79.6,14.7 v80,14.3 81.53,12.77 81.53,8 78.43,4.9 X1.8
+5V  (via drill 0.35)
  Top 0.152: FB1.1 74.1,53.3
  Top 0.406: IC1.5 54.7,56.3 54.2,56.8 54.2,58 53.55,58.65 C6.1 C7.1 45.85,58.65 | 45.85,58.65 45.55,58.65 45.4,58.8 | 45.85,58.65 45.4,58.2 | C3.1 74.1,51.35 74.1,53.3
  Top 0.508: IC1.5
  Top 0.61: R37.2 v31.5,81 30.5,80 30.5,64.2 | v32.45,37.5 R23.2 | v82.5,31 82.34,30.84 R28.2 | R27.2 v73,31 | R26.2 61.5,33.55 v61.5,35.5 | R24.2 42,33.55 v42,35.5 | R25.2 51.95,35.45 v52,35.5 | R36.2 v40.5,81 | R42.2 v50,81 | R41.2 v58.5,81 | JP2.2 69.5,81.5 v70,81 | 40.3,54.1 40.3,49.69 39.3,48.69 JP1.2 | 40.3,54.1 41.9,54.1 45.4,57.6 45.4,58.2 45.4,58.8 41,63.2 31.5,63.2 | R1.2 38.4,56 40.3,54.1 | v100.6,79 100.55,79.05 R10.1 | 30.5,64.2 30.5,63.2 | 30.99,63.2 30.5,63.2 | X2.1 4.9,46.9 7,49 22,49 27.6,54.6 C28.1 | C26.+ 24.75,59.95 C28.1 | C28.1 28.19,60.54 28.33,60.54 30.5,62.71 | v69.4,48.8 71.05,50.45 C3.1 | 30.5,62.71 30.5,63.2 | 30.5,62.71 30.99,63.2 | 30.99,63.2 31.5,63.2 | 30.5,64.2 31.5,63.2
  Top 1.27: IC9.3 19.14,62.06 21.4,59.8 C26.+
  Bottom 0.61: v82.5,31 v73,31 70.5,31 66,35.5 v61.5,35.5 v52,35.5 v42,35.5 37.45,35.5 35.45,37.5 v32.45,37.5 27.45,37.5 23.93,41.02 X2.1 | v31.5,81 v40.5,81 v50,81 v58.5,81 v70,81 73.26,81 77.49,76.77 R9.E 79.89,76.77 82.12,79 v100.6,79 | JP1.2 37.79,46.69 39.39,45.09 68.49,45.09 69.4,46 v69.4,48.8
+12V
  Top 0.61: 105.68,16.8 IC8.3 | C25.+ 110.5,20.46 C27.1 110.46,22.94 107.2,26.2 107.08,26.32 | 107.08,26.32 106.47,26.93 | R58.1 91.2,26.6 92.2,25.6 105,25.6 105.72,26.32 105.88,26.32 107.08,26.32 | 107.08,26.32 106.97,26.43 106.97,27.43
  Top 0.813: 112.1,48 120.6,48 121.15,47.45 Q2.E 119.25,45.1 R50.2 | 119.95,68.55 119.95,80.85 121.1,82 R56.2 125.15,84.55 126.7,86.1 Q7.E | 112.1,48 110.6,49.5 110.6,66.5 112.65,68.55 119.95,68.55 | 119.95,68.55 121.1,67.4 121.1,64.65 Q1.E 119.25,64.6 R48.2 | 105.88,26.32 106.47,26.93 106.97,27.43 110.6,31.05 110.6,46.5 112.1,48
  Top 1.016: C25.+ 105.68,16.8
+24V  (via drill 0.35)
  Top 1.016: D3.A 126.4,5.03 126.4,3.2
  Top 1.27: 160.7,51.49 X7.3 | v79.1,8.9 89.9,8.9 95.6,3.2 126.4,3.2 136,3.2 138.7,5.9 138.7,15.73 C15.+
  Top 2.54: 160.7,51.49 159.57,52.62 D7.C 144.44,52.58 148.5,52.58 D6.C 150.3,50.78 150.3,34.3 137,21 C15.+ | X7.3 160.89,51.49 158.6,49.2 158.6,43 160.6,41 162.62,41 X7.1
  Bottom 1.27: X1.1 38.97,6.87 41,8.9 v79.1,8.9
  Bottom 2.54: F1.2 150.76,26.35 D2.C 145.25,23.82 142.43,21 C15.+
ACEITE_ALTO  (via drill 0.35)
  Top 0.305: R32.2 63.95,31 C11.1 65.65,31.05 65.8,31.2 65.8,36.1 64.8,37.1 61.4,37.1 60.7,37.8 v60.7,38.9 | IC1.16 61.2,48.7 61.4,48.5 v61.4,43.4
  Bottom 0.305: v61.4,43.4 61.4,42.4 60.7,41.7 v60.7,38.9
ACEITE_BAJO  (via drill 0.35)
  Top 0.305: R31.2 52,31.05 C10.1 55.5,31.05 56.1,31.65 56.1,36.7 57.1,37.7 59,37.7 59.9,38.6 v59.9,39.7 | v59.6,43.6 IC1.14
  Bottom 0.305: v59.6,43.6 59.9,43.3 v59.9,39.7
D4
  Top 0.305: R5.1 89.7,84.55 92.36,87.21 JP2.11
D5
  Top 0.305: R6.1 91.9,84.41 94.9,87.41 JP2.12
D6
  Top 0.305: R7.1 94.1,84.27 97.44,87.61 JP2.13
D7
  Top 0.305: R8.1 96.3,83.93 99.98,87.61 JP2.14
EN
  Top 0.305: R4.1 87.5,84.05 86,85.55 80.96,85.55 79.66,86.85 JP2.6
ENCA
  Top 0.305: R33.2 70.95,38.25 68.7,40.5 58.7,40.5 56.2,43 IC1.11
ENCB
  Top 0.305: R34.2 79.45,38.75 77.1,41.1 59.67,41.1 58,42.77 IC1.12
GND  (via drill 0.35)
  Top 0.305: C1.2 49.45,51.83 Y1.2 51.02,51.63 C2.2
  Top 0.406: IC1.6 54.55,55.5 C6.2 C7.2 | C4.2 69.4,55.05 68.95,55.5 IC1.28
  Top 0.813: 16.6,65.16 IC9.2
  Top 1.27: X4.1 21.3,80.56 C17.- 16.94,71.54 14.8,69.4 C19.2 8.6,67.76 C23.-
  other vias: 40.8,56.2 39.8,56.2 45.4,56.2 45.4,55.2 48.8,50.6 58.4,56 58.4,55 61.6,59.4 61.6,58.4 66.2,57.8 66.2,56.8 60.6,51.6 61.6,51.6 107,86.4 107,85.4 107,84.4 65.8,86 65.8,85 65.8,84 39.8,82.6 38.8,82.6 47.4,82.6 46.4,82.6 56.6,82.8 55.6,82.8 19.2,33.4 18.2,33.4 18.2,38.4 19.2,38.4 19,28.2 18,28.2 64,43.8 67.2,46.8 68.2,46.8 77,46.6 78,46.6 78.4,50.2 79.4,50.2 17.8,23.2 18.8,23.2 35.8,28.8 36.8,28.8 44.4,28.8 45.4,28.8 54.6,28.8 55.6,28.8 64,28.8 65,28.8 73.2,28.8 74.2,28.8 82,28.8 83,28.8 64.8,39.2 65.8,39.2 73.6,39.8 74.6,39.8 80.6,40.8 81.6,40.8 54.2,40.8 55.2,40.8 40.8,39 41.8,39 39.8,39 30.6,41.4 31.6,41.4 32.6,41.4 9.8,45.2 10.8,45.2 11.8,45.2 5.8,62 5.8,61 27,65.8 27,64.8 27,63.8 73.4,63 73.4,62 80,57.4 80,56.4 80,55.4 108,77.4 109,77.4 110,77.4 102.4,59.8 103.4,59.8 104.4,59.8 101.4,42.2 102.4,42.2 100.4,42.2 92,95.4 93,95.4 94,95.4 70.8,77.8 70.8,76.8 70.8,75.8 62.4,47.8 62.4,46.8 48.6,43.8 49.6,43.8 43.4,48.4 43.4,47.4 41.4,70.2 42.4,70.2 43.4,70.2 57.8,70.4 58.8,70.4 59.8,70.4 89.2,46.6 90.2,46.6 87.8,64.2 88.8,64.2 89.8,64.2 91.2,46.6 82.4,44.2 63,43.8 45.6,61 46.6,61 47.6,61 51.4,61 49.6,50 5.8,63 5.8,64 5.8,65 60.8,63.4 61.8,63.4 62.8,63.4 45.6,63.2 46.6,63.2 47.6,63.2 48.6,63.2 29.6,59.4 30.6,59.4 31.6,59.4 69.2,51 70.2,51 72.6,47.2 73.6,47.2 39.8,58.6 40.8,58.6 41.8,58.6 41.8,56.2 39.8,60.4 40.8,60.4 41.8,60.4 45.4,54.2 73.4,61 73.4,60 63.8,63.4 53.8,53.9
  pour Top (isolate 0.3): 1,20.4 1,64.8 3,66.8 26.67,66.8 28.66,68.8 28.67,94.6 30.67,96.6 114.72,96.6 116.72,94.6 116.72,76.52 114.72,74.52 109,74.52 107,72.52 107,30 104,27 28.8,27 26.8,25 26.8,20.4 24.8,18.4 3,18.4
  pour Bottom (isolate 0.3): 26.79,24.99 26.8,20.41 24.8,18.4 3,18.4 1,20.4 1,64.8 3,66.8 26.67,66.8 28.67,68.78 28.67,94.59 30.67,96.58 114.72,96.58 116.72,94.58 116.72,76.52 114.72,74.52 109,74.52 107,72.52 107,30 104,27 82.39,27 28.79,27
GND1  (via drill 0.35)
  Top 0.61: v123,75 123,76.98 122.25,77.73 IC12.3 | 113.2,14.5 113.45,14.5 | C18.2 116.35,7.41 | 115.5,20.46 C27.2
  Top 0.813: IC11.3 112.25,40.75 v113,40 | IC10.3 112.25,60.75 v113,60
  Top 1.016: K1.1 130.77,75.03 130,75.8 | D9.A 130,75.8 | 130,75.8 129.2,75 v123,75 | IC8.2 113.2,14.5 C25.- 115.5,20.46 | 113.45,14.5 C20.- 116.35,7.41
  Top 1.27: Q4.C 123.6,38 123.95,38.35 124.02,38.75 R53.1 124.55,41 125.6,42.05 125.6,44.5 126.64,45.54 133.64,45.54 134.14,45.04 Q6.S 136.2,44.54 | Q3.C 124.02,57.82 R52.1 124.02,61.84 124,61.9 126.2,64.1 133.58,64.1 Q5.S 134.2,63.6 136.6,63.6
  Top 2.54: C15.- 131.63,10.84 127.2,15.27 127.2,25.4 131,29.2 136.2,29.2 140,33 140,42.6 138.6,44 | 138.6,44 138.6,62 137,63.6 136.6,63.6 | 138.6,44 138.06,44.54 136.2,44.54
  Bottom 1.016: v123,75 119,75 113,69 v113,60 v113,40 113,23.04 C27.2 | C15.- 119.78,10.84 C18.2
  Bottom 2.54: X5.1 159.98,8.58 D2.A 135.69,8.58 C15.-
  pour Top (no thermals): 132.8,63.8 133.6,64.6 137.4,64.6 137.4,62.2 136.2,62.2 135.6,62.8 133.4,62.8 132.8,63.4
  pour Top (no thermals): 133,44.8 133.8,45.6 137.8,45.6 138,45.4 138,43.6 137.8,43.4 135.6,43.4 135.2,43.8 133.4,43.8 133,44.2
MISO  (via drill 0.35)
  Top 0.305: IC1.2 v59.5,58.7
  Bottom 0.305: v59.5,58.7 59.5,57.5 59.1,57.1 38.79,57.1 37.79,56.1 JP1.1
MOSI  (via drill 0.35)
  Top 0.305: IC1.1 58.3,59.5 58.31,59.51 v60.2,59.51
  Bottom 0.305: v60.2,59.51 33.73,59.51 30.71,56.49 30.71,48.23 31.85,47.09 34.55,47.09 35.25,47.79 JP1.4
N$1
  Top 0.305: IC1.7 54,54.7 53.5,55.2 51.44,55.2 50.83,54.59 Y1.1 50.36,53.71 C1.1
N$2
  Top 0.305: IC1.8 55.3,53.9 53.23,51.83 Y1.3 52.58,50.28 C2.1
N$3
  Top 0.508: IC1.29 70.44,56.3 C5.1
N$4
  Top 0.305: JP2.3 72.04,82.96 73.15,81.85 R9.S
N$5
  Top 0.406: FB1.2 70.05,53.3 C4.1 68.65,54.7 IC1.27
N$6  (via drill 0.35)
  Top 0.305: R8.2 96.3,77.1 90.4,71.2 79,71.2 77.4,69.6 v77.4,68.2 | IC1.26 66.1,53.9 v65.9,53.7
  Bottom 0.305: v77.4,68.2 77.4,56.9 74.4,53.9 66.3,53.9 66.1,53.7 v65.9,53.7
N$7  (via drill 0.35)
  Top 0.305: R7.2 94.1,76.9 89,71.8 78.07,71.8 76.09,69.82 v76.09,68.2 | IC1.25 66.6,53.1 66.2,52.7 65.2,52.7 v64.9,53
  Bottom 0.305: v76.09,68.2 76.49,67.8 76.49,57.49 73.6,54.6 65.3,54.6 64.9,54.2 v64.9,53
N$8  (via drill 0.35)
  Top 0.305: R6.2 91.9,76.7 87.6,72.4 77.14,72.4 74.98,70.25 v74.98,68.2 | v64,53.9 64,52.7 64.6,52.1 66.6,52.1 66.8,52.3 IC1.24
  Bottom 0.305: v74.98,68.2 74.98,67.8 75.78,67 75.78,58.08 72.9,55.2 64.7,55.2 64,54.5 v64,53.9
N$9  (via drill 0.35)
  Top 0.305: R5.2 89.6,78.95 89.6,76.4 86.2,73 76.21,73 73.87,70.67 v73.87,68.2 | v63.3,52.2 64,51.5 IC1.23
  Bottom 0.305: v73.87,68.2 73.87,67.6 74.87,66.6 74.87,58.57 72.1,55.8 64.2,55.8 63.1,54.7 63.1,52.4 v63.3,52.2
N$10
  Top 1.27: X4.3 11.1,92.9 11.1,89.12 7.4,85.42 D1.A
N$11  (via drill 0.35)
  Top 0.305: IC1.21 65.2,46 66,45.2 78.5,45.2 81.59,48.29 v81.59,51.69 v81.6,51.7 | R4.2 87.7,78.85 87.7,76.55 86.65,75.5 v81.5,75.5
  Bottom 0.305: v81.5,75.5 81.5,75.4 81.6,75.3 v81.6,51.7
N$12  (via drill 0.35)
  Top 0.305: IC1.20 64.4,45.87 65.87,44.4 79.23,44.4 82.4,47.57 v82.4,50.89 | v82.4,50.89 | v82.2,76.4 84.58,76.4 85.4,77.22 R3.2
  Bottom 0.305: v82.2,76.4 82.4,76.2 v82.4,50.89
N$13  (via drill 0.35)
  Top 0.305: IC1.19 63.6,45.84 65.64,43.8 79.96,43.8 83.31,47.15 v83.31,51.6 | R2.2 83.2,77.6 v82.9,77.3
  Bottom 0.305: v82.9,77.3 83.31,76.89 v83.31,51.6
N$14
  Top 0.305: R10.2 98.4,83.49 102.52,87.61 JP2.15
N$17
  Top 0.305: 31.05,22.07 IC2.1 31.23,19.95 R11.2 R17.2 33.95,20.17
N$18
  Top 0.305: R23.1 R29.1 30.55,29.43 IC2.4
N$19
  Top 0.305: X2.2 15.36,36.02 R35.1
N$21
  Top 0.305: 40.05,22.07 IC3.1 40.23,19.99 R12.2 R18.2
N$22
  Top 0.61: 110.98,10.67 C20.+ 109.69,11.96
  Top 1.016: D3.C 118.38,5.4 112.7,5.4 C18.1 110.98,10.67 | 109.69,11.96 IC8.1
N$26
  Top 0.305: R24.1 R30.1 40.05,28.93 IC3.4
N$27
  Top 0.305: 101.82,44.77 R47.2 101.65,44.4 105.62,44.4 IC11.1
N$29
  Top 0.305: 53.45,20.17 R19.2 R13.2 50.23,19.99 IC4.1
N$30
  Top 0.305: R25.1 R31.1 50.05,28.93 IC4.4
N$33
  Top 0.305: R14.2 60.2,19.72 | 60.2,19.72 R20.2 | 60.2,19.72 59.73,20.19 IC5.1
N$34
  Top 0.305: R26.1 R32.1 59.73,30.82 IC5.4
N$35
  Top 0.813: SG1.+ 103.78,30.85 D8.C 94.55,30.85 92.85,32.55 R58.2
N$37
  Top 0.305: 71.98,19.74 R21.2 R15.2 69.5,21.76 69.01,22.25 IC6.1
N$38
  Top 0.305: IC6.4 68.73,30.68 R27.1 R33.1
N$39
  Top 0.305: D5.A 119.15,41 R53.2 | R53.2 121.65,39.6 Q4.B | Q2.C 122.1,41.45 R53.2
N$41
  Top 0.305: 80.45,20.17 R22.2 R16.2 77.23,19.99 IC7.1
N$42
  Top 0.305: IC7.4 77.23,30.48 R28.1 77.55,30.88 R34.1
N$43
  Top 0.305: R51.1 113.09,44.95 112.41,44.27 IC11.4
N$44
  Top 0.305: X1.7 69,8 70.6,9.6 74.9,9.6 77.5,12.2 R16.1
N$45
  Top 0.305: R15.1 69.5,11.7 67.4,9.6 65.2,9.6 64.02,8.42 X1.6
N$46
  Top 0.305: X1.5 59,8.6 60,9.6 R14.1
N$47
  Top 0.305: X1.4 54,10.4 50.5,13.9 R13.1
N$48
  Top 0.305: X1.3 48.98,8.52 47.3,10.2 44.6,10.2 40.5,14.3 R12.1
N$49
  Top 0.305: X1.2 44,7.8 42.6,9.2 33.6,9.2 31,11.8 R11.1
N$50  (via drill 0.35)
  Top 0.305: R50.1 R51.2 v116.6,41 | v124.6,45.5 124.2,45.1 Q2.B
  Bottom 0.305: v116.6,41 116.6,43.5 118.6,45.5 v124.6,45.5
N$51
  Top 0.305: 105.26,64.3 105,64.3 | 105,64.3 101.85,64.3 R46.2 | IC10.1 105.03,64.27 105,64.3
N$52
  Top 0.305: D5.C 119.1,37.65 119.7,37.05 Q4.E 121,36.05 121.55,35.5 132.1,35.5 134.14,37.54 Q6.G
N$53
  Bottom 2.54: X5.3 163.1,24.6 159.4,28.3 F1.1
N$54
  Bottom 1.27: 137.7,41.6 137.34,41.6 136.94,42 Q6.D
  Bottom 2.54: 137.7,41.6 141.92,37.38 D7.A 153.48,37.38 155.6,39.5 155.6,44.5 157.61,46.51 X7.2
  pour Bottom (no thermals): 133,42 133.6,42.6 135.6,42.6 136.2,43.2 137.6,43.2 138.7,42.1 137.4,40.8 136.8,40.8 136.2,41.4 133.2,41.4 133,41.6
N$55
  Bottom 2.54: K1.S 161.63,75.03 X8.1
N$56
  Bottom 2.54: K1.P 162.6,81 X8.2
N$57
  Top 0.305: R49.1 116.42,64.27 IC10.4
N$58  (via drill 0.35)
  Top 0.305: R48.1 R49.2 v116.6,60.5 | v124.6,65 124.2,64.6 Q1.B
  Bottom 0.305: v116.6,60.5 116.6,63.5 118.1,65 v124.6,65
N$59
  Top 0.305: D4.A 121.2,60.45 121.38,60.27 | 121.38,60.27 R52.2 121.65,58.6 Q3.B | Q1.C 122.1,61 121.38,60.27
N$60
  Top 1.27: D1.C 9.6,79.17 11.86,76.92 C17.+ 8.86,73.2 7.2,73.2 5.16,71.16 C19.1 4,68.24 4,60.2 5.25,58.95 C23.+ 12.15,58.95 14.06,60.86 IC9.1
N$61
  Top 0.305: D4.C 119.1,56.75 119.8,56.05 Q3.E 121,54.6 121.6,54 131.8,54 132.1,54 134.14,56.04 Q5.G
N$62
  Bottom 1.27: Q5.D 137.28,61
  Bottom 2.54: 137.28,61 142.7,66.42 D6.A 158.2,66.42 163.1,61.52 X7.4
  pour Bottom (no thermals): 132.8,61.2 133.2,61.6 135.6,61.6 141.6,67.6 151.6,67.6 151.8,67.4 151.8,65.6 151.6,65.4 143,65.4 137.4,59.8 136,59.8 135.4,60.4 133.2,60.4 132.8,60.8
N$63
  Top 0.305: R54.2 113.98,79.96 114.29,80.27 IC12.1
N$64
  Top 0.305: R57.1 124.38,80.27 IC12.4
N$65  (via drill 0.35)
  Top 0.305: R57.2 R56.1 127.05,83.55 v126.6,84 | v130.1,87.5 130.1,86.15 Q7.B
  Bottom 0.305: v126.6,84 127.6,84 130.1,86.5 v130.1,87.5
N$66
  Top 0.305: 130,82 D9.C
  Top 0.813: K1.2 133.04,83.9 Q7.C 130,83 130,82
N$67
  Bottom 2.54: K1.O 162.63,86.97 X8.3
N$68
  Top 0.305: X2.3 15.36,31.02 R40.1
N$69
  Top 0.305: X2.4 4.92,26 R45.1
N$70
  Top 0.305: R39.1 36.45,78.5 R37.1 36.5,81.05 36.5,87 35.5,88 33.69,88 32.69,89 X3.1
N$71
  Top 0.305: R36.1 44.5,80.95 | 44.5,80.95 R38.1 | X3.3 40.31,89 41.31,88 43.5,88 44.5,87 44.5,80.95
N$72
  Top 0.305: R44.1 54,80.95 R42.1 53.95,87 52.95,88 51.19,88 50.19,89 X6.1
N$73
  Top 0.305: 92.2,37.25 R55.1 92.3,37.35 T2.B
N$74
  Top 0.305: R43.1 62.5,80.95 R41.1 62.5,81.05 62.5,87 61.5,88 58.81,88 57.81,89 X6.3
N$119
  Top 0.813: SG1.- 103.63,38.52 101.51,36.4 T2.C 96.7,34.56 95.89,33.75 D8.A
PEDAL_MARCHA
  Top 0.305: R30.2 42,31.05 C9.1 47.1,31.05 48.1,32.05 48.1,37.3 54.5,43.7 54.5,51.4 55.4,52.3 IC1.10
POSICION_1  (via drill 0.35)
  Top 0.305: R35.2 19.8,36 20.2,36.4 21.85,36.4 C12.1 24,38.55 24,39.85 28.75,44.6 43.37,44.6 46.77,48 v52.6,48 | v63.6,59.3 IC1.37
  Bottom 0.305: v52.6,48 53,48 63.6,58.6 v63.6,59.3
POSICION_2  (via drill 0.35)
  Top 0.305: R40.2 19.8,31 20.25,31.45 C16.1 24.35,31.45 25,32.1 25,39.5 29.2,43.7 43.8,43.7 47.21,47.11 v50.9,47.11 | v64.4,58.6 IC1.36
  Bottom 0.305: v50.9,47.11 53.39,47.11 64.4,58.12 v64.4,58.6
POSICION_3  (via drill 0.35)
  Top 0.305: R45.2 19.8,26 20.25,26.45 C24.1 24.25,26.45 25.9,28.1 25.9,39.1 29.7,42.9 44.1,42.9 46.6,45.4 51.7,45.4 v52.5,46.2 | v65.2,59.4 IC1.35
  Bottom 0.305: v52.5,46.2 53.77,46.2 65.2,57.63 v65.2,59.4
PWM1
  Top 0.305: IC1.13 58.8,42.8 59.8,41.8 91.6,41.8 94.3,44.5 R47.1
PWM2
  Top 0.305: R46.1 97.4,64 94,60.6 94,45.2 91.3,42.5 61,42.5 60.6,42.9 60.6,44 60.4,44.2 IC1.15
RELE_AUX  (via drill 0.35)
  Top 0.305: v66.5,66.7 61.8,66.7 58.8,63.7 IC1.43 | v72.3,65.7 104.1,65.7 106.27,67.87 106.27,78.36 107.87,79.96 R54.1
  Bottom 0.305: v72.3,65.7 67.5,65.7 v66.5,66.7
RESET  (via drill 0.35)
  Top 0.305: JP1.5 32.8,51.32 32.8,55.85 R1.1 32.85,56.2 32.85,57.85 36.8,61.8 v40.8,61.8 | IC1.4 55.3,57.1 55,57.4 55,59 51.8,62.2 44.2,62.2 v43.8,61.8
  Bottom 0.305: v43.8,61.8 v40.8,61.8
RS
  Top 0.305: R2.1 83.2,83.35 82.7,83.85 77.18,83.85 74.58,86.45 JP2.4
RW
  Top 0.305: R3.1 85.4,83.55 84.3,84.65 79.12,84.65 77.12,86.65 JP2.5
SCK  (via drill 0.35)
  Top 0.305: IC1.3 58.5,57.9 58.51,57.89 v58.6,57.89
  Bottom 0.305: v58.6,57.89 58.4,57.69 36.69,57.69 35.25,56.25 JP1.3
SENSOR_PROT
  Top 0.305: R29.2 32.5,31.05 C8.1 36.6,31.05 37.6,32.05 37.6,36.2 38.6,37.2 46.9,37.2 53.9,44.2 53.9,51.6 55.4,53.1 IC1.9
X1
  Top 0.305: R39.2 C14.1 39,73.4 40.4,72 64.3,72 69.4,66.9 69.4,60 68.9,59.5 IC1.33
X2
  Top 0.305: R38.2 C13.1 47,74.5 48.66,72.84 64.36,72.84 70.1,67.1 70.1,59.9 68.9,58.7 IC1.32
X3
  Top 0.305: R44.2 C22.1 56.5,74.7 57.6,73.6 64.6,73.6 70.8,67.4 70.8,59.8 68.9,57.9 IC1.31
X4
  Top 0.305: R43.2 C21.1 65,74.2 71.5,67.7 71.5,59.39 69.21,57.1 IC1.30
ZUMBADOR  (via drill 0.35)
  Top 0.305: v73.2,64.8 81.4,64.8 84.2,62 84.2,47 v87,44.2 | v67.2,67.5 61.5,67.5 58,64 IC1.44 | v88,37.2 R55.2
  Bottom 0.305: v73.2,64.8 73.2,66 72.6,66.6 68.1,66.6 v67.2,67.5 | v87,44.2 87,38.2 v88,37.2

### Text on the board
tPlace: 1 | DI1 | GND | DI2 | GND | DI3 | GND | DI4 | GND | + | - | DIGITAL INPUTS | NC | 24VDC SUPPLY | COM | RELAY OUTPUT | NO | LCD / CONTRAST | - | LOAD 2 | + | - | LOAD 1 | + | +5V | AI1 | AI2 | AI3 | ANALOG INPUTS | + | +GND | DC POWER | +24V | S. PROT | RUN | DIGITAL INPUTS | OIL H. | OIL L. | ENCA | ENCB | 0V | - | www.eplimin.com